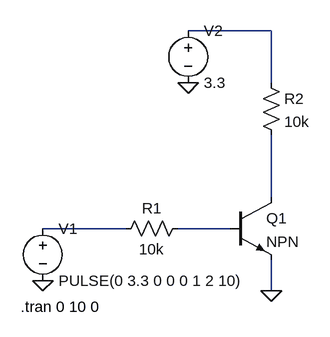
[diagram p0: schematic Not gate.asc]
Not gate.asc, the LTspice schematic file:
Version 4
SHEET 1 880 680
WIRE 256 -128 128 -128
WIRE 256 -48 256 -128
WIRE 256 128 256 32
WIRE 32 176 -96 176
WIRE 192 176 112 176
WIRE 256 272 256 224
FLAG -96 256 0
FLAG 128 -48 0
FLAG 256 272 0
SYMBOL npn 192 128 R0
SYMATTR InstName Q1
SYMBOL voltage -96 160 R0
WINDOW 123 0 0 Left 0
WINDOW 39 0 0 Left 0
SYMATTR InstName V1
SYMATTR Value PULSE(0 3.3 0 0 0 1 2 10)
SYMBOL voltage 128 -144 R0
WINDOW 123 0 0 Left 0
WINDOW 39 0 0 Left 0
SYMATTR InstName V2
SYMATTR Value 3.3
SYMBOL res 128 160 R90
WINDOW 0 0 56 VBottom 2
WINDOW 3 32 56 VTop 2
SYMATTR InstName R1
SYMATTR Value 10k
SYMBOL res 240 -64 R0
SYMATTR InstName R2
SYMATTR Value 10k
TEXT -130 296 Left 2 !.tran 0 10 0

The netlist it stands for:
* Not gate.asc
Q1 N002 N004 0 0 NPN
V1 N003 0 PULSE(0 3.3 0 0 0 1 2 10)
V2 N001 0 3.3
R1 N004 N003 10k
R2 N001 N002 10k
.model NPN NPN
.model PNP PNP
.lib standard.bjt
.tran 0 10 0
.backanno
.end